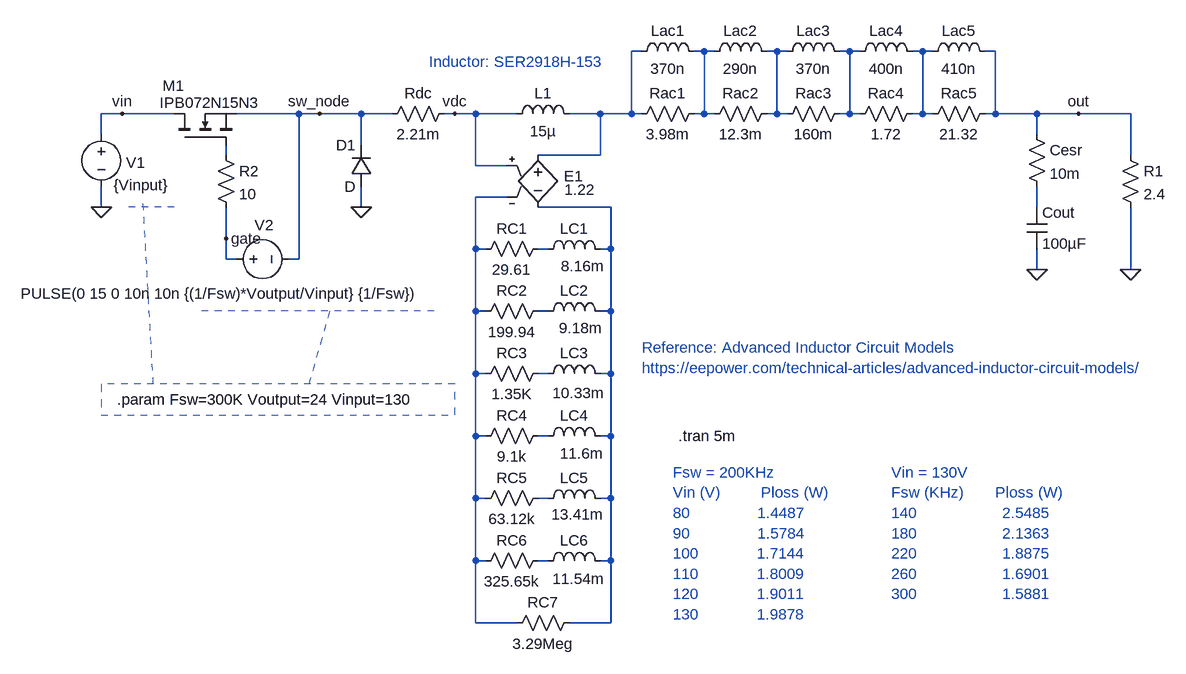
[diagram p0: schematic 09-SER2918H-153_non-linear_model_transient_ridley.asc]
09-SER2918H-153_non-linear_model_transient_ridley.asc, the LTspice schematic file:
Version 4
SHEET 1 1668 1520
WIRE 96 112 80 112
WIRE 192 112 176 112
WIRE 208 112 192 112
WIRE 304 112 288 112
WIRE 320 112 304 112
WIRE 416 112 400 112
WIRE 432 112 416 112
WIRE 528 112 512 112
WIRE 544 112 528 112
WIRE 640 112 624 112
WIRE -704 208 -736 208
WIRE -624 208 -704 208
WIRE -432 208 -528 208
WIRE -400 208 -432 208
WIRE -336 208 -400 208
WIRE -288 208 -336 208
WIRE -192 208 -208 208
WIRE -160 208 -192 208
WIRE -96 208 -160 208
WIRE 32 208 -16 208
WIRE 80 208 80 112
WIRE 80 208 32 208
WIRE 96 208 80 208
WIRE 192 208 192 112
WIRE 192 208 176 208
WIRE 208 208 192 208
WIRE 304 208 304 112
WIRE 304 208 288 208
WIRE 320 208 304 208
WIRE 416 208 416 112
WIRE 416 208 400 208
WIRE 432 208 416 208
WIRE 528 208 528 112
WIRE 528 208 512 208
WIRE 544 208 528 208
WIRE 640 208 640 112
WIRE 640 208 624 208
WIRE 704 208 640 208
WIRE 768 208 704 208
WIRE 848 208 768 208
WIRE -736 240 -736 208
WIRE 704 240 704 208
WIRE -336 256 -336 208
WIRE -544 272 -544 256
WIRE 32 272 32 208
WIRE 32 272 -64 272
WIRE 848 272 848 208
WIRE -160 288 -160 208
WIRE -112 288 -160 288
WIRE -112 336 -160 336
WIRE -736 352 -736 320
WIRE -336 352 -336 320
WIRE 48 352 -64 352
WIRE 704 352 704 320
WIRE -544 400 -544 352
WIRE -160 416 -160 336
WIRE -144 416 -160 416
WIRE -48 416 -64 416
WIRE 48 416 48 352
WIRE 48 416 32 416
WIRE -544 432 -544 400
WIRE -528 432 -544 432
WIRE -432 432 -432 208
WIRE -432 432 -448 432
WIRE 704 448 704 416
WIRE 848 448 848 352
WIRE -160 512 -160 416
WIRE -144 512 -160 512
WIRE -48 512 -64 512
WIRE 48 512 48 416
WIRE 48 512 32 512
WIRE -160 608 -160 512
WIRE -144 608 -160 608
WIRE -48 608 -64 608
WIRE 48 608 48 512
WIRE 48 608 32 608
WIRE -160 704 -160 608
WIRE -144 704 -160 704
WIRE -48 704 -64 704
WIRE 48 704 48 608
WIRE 48 704 32 704
WIRE -160 800 -160 704
WIRE -144 800 -160 800
WIRE -48 800 -64 800
WIRE 48 800 48 704
WIRE 48 800 32 800
WIRE -160 896 -160 800
WIRE -144 896 -160 896
WIRE -48 896 -64 896
WIRE 48 896 48 800
WIRE 48 896 32 896
WIRE -160 992 -160 896
WIRE -96 992 -160 992
WIRE 48 992 48 896
WIRE 48 992 -16 992
FLAG -736 352 0
FLAG -192 208 vdc
FLAG 704 448 0
FLAG 848 448 0
FLAG -336 352 0
FLAG 768 208 out
FLAG -400 208 sw_node
FLAG -704 208 vin
FLAG -544 400 gate
SYMBOL voltage -736 224 R0
WINDOW 123 21 95 Left 2
WINDOW 39 0 0 Left 0
WINDOW 0 38 59 Left 2
WINDOW 3 19 94 Left 2
SYMATTR InstName V1
SYMATTR Value {Vinput}
SYMBOL res -192 192 R90
WINDOW 0 0 56 VBottom 2
WINDOW 3 32 56 VTop 2
SYMATTR InstName Rdc
SYMATTR Value 2.21m
SYMBOL res 192 192 R90
WINDOW 0 0 56 VBottom 2
WINDOW 3 32 56 VTop 2
SYMATTR InstName Rac1
SYMATTR Value 3.98m
SYMBOL res 304 192 R90
WINDOW 0 0 56 VBottom 2
WINDOW 3 32 56 VTop 2
SYMATTR InstName Rac2
SYMATTR Value 12.3m
SYMBOL res 416 192 R90
WINDOW 0 0 56 VBottom 2
WINDOW 3 32 56 VTop 2
SYMATTR InstName Rac3
SYMATTR Value 160m
SYMBOL res 528 192 R90
WINDOW 0 0 56 VBottom 2
WINDOW 3 32 56 VTop 2
SYMATTR InstName Rac4
SYMATTR Value 1.72
SYMBOL res 640 192 R90
WINDOW 0 0 56 VBottom 2
WINDOW 3 32 56 VTop 2
SYMATTR InstName Rac5
SYMATTR Value 21.32
SYMBOL ind 80 128 R270
WINDOW 0 32 56 VTop 2
WINDOW 3 5 56 VBottom 2
SYMATTR InstName Lac1
SYMATTR Value 370n
SYMBOL ind 192 128 R270
WINDOW 0 32 56 VTop 2
WINDOW 3 5 56 VBottom 2
SYMATTR InstName Lac2
SYMATTR Value 290n
SYMBOL ind 304 128 R270
WINDOW 0 32 56 VTop 2
WINDOW 3 5 56 VBottom 2
SYMATTR InstName Lac3
SYMATTR Value 370n
SYMBOL ind 416 128 R270
WINDOW 0 32 56 VTop 2
WINDOW 3 5 56 VBottom 2
SYMATTR InstName Lac4
SYMATTR Value 400n
SYMBOL ind 528 128 R270
WINDOW 0 32 56 VTop 2
WINDOW 3 5 56 VBottom 2
SYMATTR InstName Lac5
SYMATTR Value 410n
SYMBOL ind -112 224 R270
WINDOW 0 32 56 VTop 2
WINDOW 3 5 56 VBottom 2
SYMATTR InstName L1
SYMATTR Value 15µ
SYMBOL res -48 400 R90
WINDOW 0 0 56 VBottom 2
WINDOW 3 32 56 VTop 2
SYMATTR InstName RC1
SYMATTR Value 29.61
SYMBOL ind -64 432 R270
WINDOW 0 32 56 VTop 2
WINDOW 3 5 69 VBottom 2
SYMATTR InstName LC1
SYMATTR Value 8.16m
SYMBOL res -48 496 R90
WINDOW 0 0 56 VBottom 2
WINDOW 3 32 56 VTop 2
SYMATTR InstName RC2
SYMATTR Value 199.94
SYMBOL ind -64 528 R270
WINDOW 0 32 56 VTop 2
WINDOW 3 6 66 VBottom 2
SYMATTR InstName LC2
SYMATTR Value 9.18m
SYMBOL res -48 592 R90
WINDOW 0 0 56 VBottom 2
WINDOW 3 32 56 VTop 2
SYMATTR InstName RC3
SYMATTR Value 1.35K
SYMBOL ind -64 624 R270
WINDOW 0 32 56 VTop 2
WINDOW 3 2 63 VBottom 2
SYMATTR InstName LC3
SYMATTR Value 10.33m
SYMBOL res -48 688 R90
WINDOW 0 0 56 VBottom 2
WINDOW 3 32 56 VTop 2
SYMATTR InstName RC4
SYMATTR Value 9.1k
SYMBOL ind -64 720 R270
WINDOW 0 32 56 VTop 2
WINDOW 3 5 68 VBottom 2
SYMATTR InstName LC4
SYMATTR Value 11.6m
SYMBOL res -48 784 R90
WINDOW 0 0 56 VBottom 2
WINDOW 3 32 56 VTop 2
SYMATTR InstName RC5
SYMATTR Value 63.12k
SYMBOL ind -64 816 R270
WINDOW 0 32 56 VTop 2
WINDOW 3 7 61 VBottom 2
SYMATTR InstName LC5
SYMATTR Value 13.41m
SYMBOL res -48 880 R90
WINDOW 0 0 56 VBottom 2
WINDOW 3 32 56 VTop 2
SYMATTR InstName RC6
SYMATTR Value 325.65k
SYMBOL ind -64 912 R270
WINDOW 0 32 56 VTop 2
WINDOW 3 4 63 VBottom 2
SYMATTR InstName LC6
SYMATTR Value 11.54m
SYMBOL res 0 976 R90
WINDOW 0 0 56 VBottom 2
WINDOW 3 32 56 VTop 2
SYMATTR InstName RC7
SYMATTR Value 3.29Meg
SYMBOL e -64 256 R0
WINDOW 0 40 48 Left 2
WINDOW 3 41 69 Left 2
SYMATTR InstName E1
SYMATTR Value 1.22
SYMBOL res 688 224 R0
SYMATTR InstName Cesr
SYMATTR Value 10m
SYMBOL cap 688 352 R0
SYMATTR InstName Cout
SYMATTR Value 100µF
SYMBOL res 832 256 R0
SYMATTR InstName R1
SYMATTR Value 2.4
SYMBOL diode -320 320 R180
WINDOW 0 24 64 Left 2
WINDOW 3 24 0 Left 2
SYMATTR InstName D1
SYMBOL nmos -624 256 R270
WINDOW 0 91 -18 VRight 2
WINDOW 3 65 -22 VRight 2
SYMATTR InstName M1
SYMATTR Value IPB072N15N3
SYMBOL voltage -544 432 R270
WINDOW 0 53 44 VRight 2
WINDOW 3 -53 -316 VRight 2
WINDOW 123 0 0 Left 0
WINDOW 39 0 0 Left 0
SYMATTR InstName V2
SYMATTR Value PULSE(0 15 0 10n 10n {(1/Fsw)*Voutput/Vinput} {1/Fsw})
SYMBOL res -560 256 R0
SYMATTR InstName R2
SYMATTR Value 10
TEXT -232 128 Left 2 ;Inductor: SER2918H-153
TEXT 96 568 Left 2 ;Reference: Advanced Inductor Circuit Models\nhttps://eepower.com/technical-articles/advanced-inductor-circuit-models/
TEXT -712 648 Left 2 !.param Fsw=300K Voutput=24 Vinput=130
TEXT 152 704 Left 2 !.tran 5m
TEXT 144 760 Left 2 ;Fsw = 200KHz\nVin (V)         Ploss (W)\n80               1.4487\n90               1.5784\n100             1.7144\n110             1.8009\n120             1.9011\n130             1.9878
TEXT 480 760 Left 2 ;Vin = 130V\nFsw (KHz)       Ploss (W)\n140                   2.5485\n180                   2.1363\n220                   1.8875\n260                   1.6901\n300                   1.5881
LINE Normal -656 624 -672 336 2
LINE Normal -416 624 -384 512 2
LINE Normal -224 512 -592 512 2
LINE Normal -624 352 -704 352 2
RECTANGLE Normal -736 672 -192 624 2

The netlist it stands for:
* 09-SER2918H-153_non-linear_model_transient_ridley.asc
V1 vin 0 {Vinput}
Rdc vdc sw_node 2.21m
Rac1 N002 N001 3.98m
Rac2 N003 N002 12.3m
Rac3 N004 N003 160m
Rac4 N005 N004 1.72
Rac5 out N005 21.32
Lac1 N001 N002 370n
Lac2 N002 N003 290n
Lac3 N003 N004 370n
Lac4 N004 N005 400n
Lac5 N005 out 410n
L1 vdc N001 15µ
RC1 N010 N007 29.61
LC1 N010 N008 8.16m
RC2 N011 N007 199.94
LC2 N011 N008 9.18m
RC3 N012 N007 1.35K
LC3 N012 N008 10.33m
RC4 N013 N007 9.1k
LC4 N013 N008 11.6m
RC5 N014 N007 63.12k
LC5 N014 N008 13.41m
RC6 N015 N007 325.65k
LC6 N015 N008 11.54m
RC7 N008 N007 3.29Meg
E1 N001 N008 vdc N007 1.22
R§Cesr out N009 10m
Cout N009 0 100µF
R1 out 0 2.4
D1 0 sw_node D
M1 vin N006 sw_node sw_node IPB072N15N3
V2 gate sw_node PULSE(0 15 0 10n 10n {(1/Fsw)*Voutput/Vinput} {1/Fsw})
R2 N006 gate 10
.model D D
.lib standard.dio
.model NMOS NMOS
.model PMOS PMOS
.lib standard.mos
* Inductor: SER2918H-153
* Reference: Advanced Inductor Circuit Models
* https://eepower.com/technical-articles/advanced-inductor-circuit-models/
.param Fsw=300K Voutput=24 Vinput=130
.tran 5m
* Fsw = 200KHz
* Vin (V)         Ploss (W)
* 80               1.4487
* 90               1.5784
* 100             1.7144
* 110             1.8009
* 120             1.9011
* 130             1.9878
* Vin = 130V
* Fsw (KHz)       Ploss (W)
* 140                   2.5485
* 180                   2.1363
* 220                   1.8875
* 260                   1.6901
* 300                   1.5881
.backanno
.end